# Altium project Reptile_Proj.PrjPcb
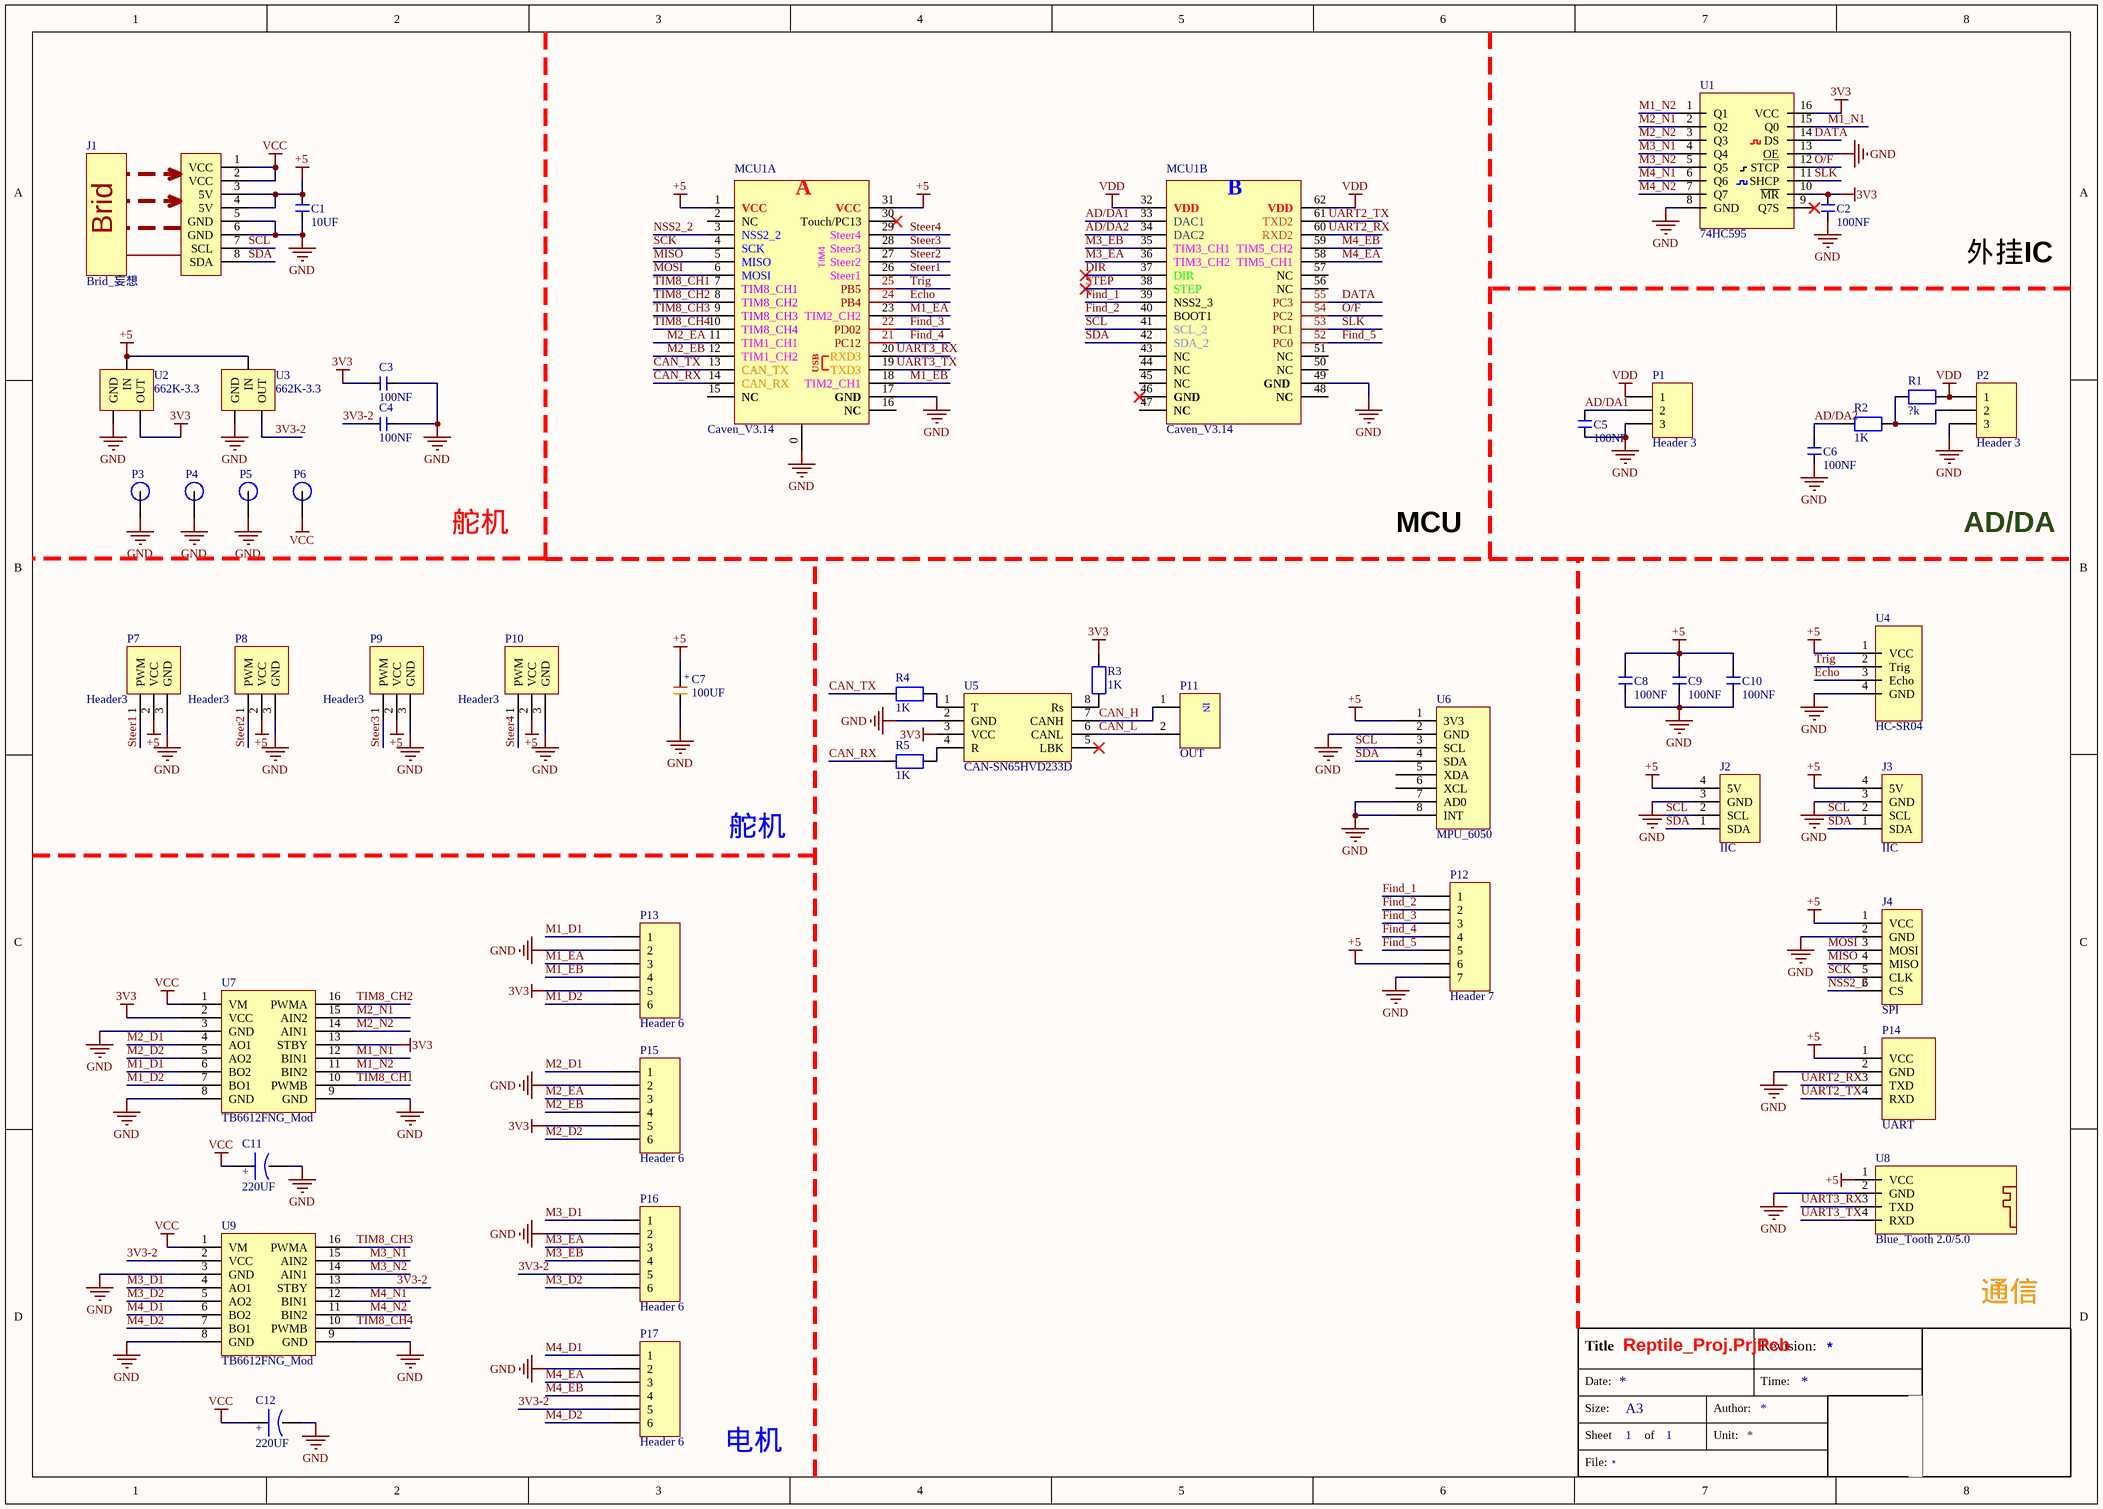
[diagram p0: Sheet.SchDoc]
1 sheet, 48 parts. Net scope: global (net labels, ports and power ports of the same name join across sheets).
Board file: PCB.PcbDoc

## Sheet Sheet.SchDoc
size A3; SheetNumber: 1; SheetTotal: 1

### Parts
C1  10UF  [CAP_1206]
C2  100NF  [CAP_0603]
C3  100NF  [CAP_0603]
C4  100NF  [CAP_0603]
C5  100NF  [CAP_0603]
C6  100NF  [CAP_0603]
C7  100UF  [CAP_3528_B]
C8  100NF  [CAP_0603]
C9  100NF  [CAP_0603]
C10  100NF  [CAP_0603]
C11  220UF  [CAPE_E]
C12  220UF  [CAPE_E]
J1  Brid_妄想  [Brid]
J2  IIC  [Header 2.54X4]
J3  IIC  [IIC-XH2.54-4PIN]
J4  SPI  [Header 2.54X6]
MCU1  Caven_V3.14  [Caven_3.14]  (parts A,B of 2)
P1  Header 3  [Header 2.54X3]
P2  Header 3  [Header 2.54X3]
P3  铜柱6m  [M3x6_L-Type]  (value not drawn)
P4  铜柱6m  [M3x6_L-Type]  (value not drawn)
P5  铜柱6m  [M3x6_L-Type]  (value not drawn)
P6  铜柱6m  [M3x6_L-Type]  (value not drawn)
P7  Header3  [PWM_Steer-F]
P8  Header3  [PWM_Steer-B]
P9  Header3  [PWM_Steer-F]
P10  Header3  [PWM_Steer-B]
P11  OUT  [PIN-2_5.08]
P12  Header 7  [Header H 2.54X7]
P13  Header 6  [XH2.54-WI-6P]
P14  UART  [UART]
P15  Header 6  [XH2.54-WI-6P]
P16  Header 6  [XH2.54-WI-6P]
P17  Header 6  [XH2.54-WI-6P]
R1  ?k  [RESC_0603_2]
R2  1K  [RESC_0603_2]
R3  1K  [RESC_0603_2]
R4  1K  [RESC_0603_2]
R5  1K  [RESC_0603_2]
U1  74HC595  [SOIC_16]
U2  662K-3.3  [SOT23_3]
U3  662K-3.3  [SOT23_3]
U4  HC-SR04  [Ultrasonic]
U5  CAN-SN65HVD233D  [SOIC_8]
U6  MPU_6050  [MPU-G521]
U7  TB6612FNG_Mod  [TB6612FNG]
U8  Blue_Tooth 2.0/5.0  [Header F 2.54X4]
U9  TB6612FNG_Mod  [TB6612FNG]

### Nets
3V3: C2.2 C3.2 P13.5 P15.5 R3.2 U1.10(~{M}~{R}) U1.16(VCC) U2.2(OUT) U5.3(VCC) U7.2(VCC) U7.13(STBY)
+5: C1.1 C7.1 C8.2 C9.2 C10.2 J1.3(5V) J1.4(5V) J2.4(5V) J3.4(5V) J4.1(VCC) MCU1.1(VCC) MCU1.31(VCC) P7.2(VCC) P8.2(VCC) P9.2(VCC) P10.2(VCC) P12.6 P14.1(VCC) U2.3(IN) U3.3(IN) U4.1(VCC) U6.1(3V3) U8.1(VCC)
GND: C1.2 C2.1 C3.1 C4.1 C5.1 C6.1 C7.2 C8.1 C9.1 C10.1 C11.2 C12.2 J1.5(GND) J1.6(GND) J2.3(GND) J3.3(GND) J4.2(GND) MCU1.0 MCU1.17(GND) MCU1.49(GND) P1.3 P2.3 P3.1(IO) P4.1(IO) P5.1(IO) P7.3(GND) P8.3(GND) P9.3(GND) P10.3(GND) P12.7 P13.2 P14.2(GND) P15.2 P16.2 P17.2 U1.8(GND) U1.13(OE) U2.1(GND) U3.1(GND) U4.4(GND) U5.2(GND) U6.2(GND) U6.7(AD0) U6.8(INT) U7.3(GND) U7.8(GND) U7.9(GND) U8.2(GND) U9.3(GND) U9.8(GND) U9.9(GND)
VCC: C11.1 C12.1 J1.1(VCC) J1.2(VCC) P6.1(IO) U7.1(VM) U9.1(VM)
VDD: MCU1.32(VDD) MCU1.62(VDD) P1.1 P2.1 R1.2
3V3-2: C4.2 P16.5 P17.5 U3.2(OUT) U9.2(VCC) U9.13(STBY)
AD/DA1: C5.2 MCU1.33(DAC1) P1.2
AD/DA2: C6.2 MCU1.34(DAC2) R2.2
CAN_H: P11.1 U5.7(CANH)
CAN_L: P11.2 U5.6(CANL)
CAN_RX: MCU1.14(CAN_RX) R5.1
CAN_TX: MCU1.13(CAN_TX) R4.1
DATA: MCU1.55(PC3) U1.14(DS)
DIR: MCU1.37(DIR)
Echo: MCU1.24(PB4) U4.3(Echo)
Find_1: MCU1.39(NSS2_3) P12.1
Find_2: MCU1.40(BOOT1) P12.2
Find_3: MCU1.22(PD02) P12.3
Find_4: MCU1.21(PC12) P12.4
Find_5: MCU1.52(PC0) P12.5
M1_D1: P13.1 U7.6(BO2)
M1_D2: P13.6 U7.7(BO1)
M1_EA: MCU1.23(TIM2_CH2) P13.3
M1_EB: MCU1.18(TIM2_CH1) P13.4
M1_N1: U1.15(Q0) U7.12(BIN1)
M1_N2: U1.1(Q1) U7.11(BIN2)
M2_D1: P15.1 U7.4(AO1)
M2_D2: P15.6 U7.5(AO2)
M2_EA: MCU1.11(TIM1_CH1) P15.3
M2_EB: MCU1.12(TIM1_CH2) P15.4
M2_N1: U1.2(Q2) U7.15(AIN2)
M2_N2: U1.3(Q3) U7.14(AIN1)
M3_D1: P16.1 U9.4(AO1)
M3_D2: P16.6 U9.5(AO2)
M3_EA: MCU1.36(TIM3_CH2) P16.3
M3_EB: MCU1.35(TIM3_CH1) P16.4
M3_N1: U1.4(Q4) U9.15(AIN2)
M3_N2: U1.5(Q5) U9.14(AIN1)
M4_D1: P17.1 U9.6(BO2)
M4_D2: P17.6 U9.7(BO1)
M4_EA: MCU1.58(TIM5_CH1) P17.3
M4_EB: MCU1.59(TIM5_CH2) P17.4
M4_N1: U1.6(Q6) U9.12(BIN1)
M4_N2: U1.7(Q7) U9.11(BIN2)
MISO: J4.4(MISO) MCU1.5(MISO)
MOSI: J4.3(MOSI) MCU1.6(MOSI)
NSS2_2: J4.6(CS) MCU1.3(NSS2_2)
O/F: MCU1.54(PC2) U1.12(STCP)
SCK: J4.5(CLK) MCU1.4(SCK)
SCL: J1.7(SCL) J2.2(SCL) J3.2(SCL) MCU1.41(SCL_2) U6.3(SCL)
SDA: J1.8(SDA) J2.1(SDA) J3.1(SDA) MCU1.42(SDA_2) U6.4(SDA)
SLK: MCU1.53(PC1) U1.11(SHCP)
Steer1: MCU1.26(Steer1) P7.1(PWM)
Steer2: MCU1.27(Steer2) P8.1(PWM)
Steer3: MCU1.28(Steer3) P9.1(PWM)
Steer4: MCU1.29(Steer4) P10.1(PWM)
STEP: MCU1.38(STEP)
TIM8_CH1: MCU1.7(TIM8_CH1) U7.10(PWMB)
TIM8_CH2: MCU1.8(TIM8_CH2) U7.16(PWMA)
TIM8_CH3: MCU1.9(TIM8_CH3) U9.16(PWMA)
TIM8_CH4: MCU1.10(TIM8_CH4) U9.10(PWMB)
Trig: MCU1.25(PB5) U4.2(Trig)
UART2_RX: MCU1.60(RXD2) P14.3(TXD)
UART2_TX: MCU1.61(TXD2) P14.4(RXD)
UART3_RX: MCU1.20(RXD3) U8.3(TXD)
UART3_TX: MCU1.19(TXD3) U8.4(RXD)
NetP2_2: P2.2 R1.1 R2.1
NetR3_1: R3.1 U5.8(Rs)
NetR4_2: R4.2 U5.1(T)
NetR5_2: R5.2 U5.4(R)

Not connected (* = marked no-connect by the designer): MCU1 2(NC) 15(NC) 16(NC) 30(Touch/PC13)* 43(NC) 44(NC) 45(NC) 46(GND)* 47(NC) 48(NC) 50(NC) 51(NC) 56(NC) 57(NC); U1 9(Q7S)*; U5 5(LBK)*; U6 5(XDA) 6(XCL)

### Notes on the sheet
- 外挂IC
- 舵机
- MCU
- AD/DA
- 通信
- 电机
- Title
- Date:
- Revision:
- Time:
- Size:
- Sheet
- A3
- of
- Author:
- Unit:
- File:
- (in symbol CAP_BIG) +
- (in symbol CAP_TA) +
- (in symbol Caven_V3.14, part A) A; TIM4; USB
- (in symbol Caven_V3.14, part B) B
- (in symbol IN _2PIN) IN

### Library data of the parts
C1-C6 C8-C10 = CAP: CAP  12~50V
C7 = CAP_TA: CAP  6~12V  钽电容
C11 C12 = CAP_BIG: CAP 12V ~ 50V   电解电容
J1 = Brid
J2 J3 = IIC: Heard
J4 = SPI: Heard
MCU1 = Caven_V3.14: MCU_STM32F103RE
P1 P2 = Header 3: Header, 3-Pin; LatestRevisionDate: 17-Jul-2002; LatestRevisionNote: Re-released for DXP Platform.; Publisher: Altium Limited
P3-P6 = Pillar: IN-OUT
P7-P10 = PWM_D: Header
P11 = IN _2PIN: Header
P12 = Header 7: Header, 7-Pin; LatestRevisionDate: 17-Jul-2002; LatestRevisionNote: Re-released for DXP Platform.; Publisher: Altium Limited
P13 P15-P17 = Header 6: Header, 6-Pin; LatestRevisionDate: 17-Jul-2002; LatestRevisionNote: Re-released for DXP Platform.; Publisher: Altium Limited
P14 = UART: Header
R1-R5 = RES: RES 贴片
U1 = 74HC595: IC
U2 U3 = 662K: DC-DC
U4 = Ultrasonic: Mode
U5 = CAN
U6 = MPU_6050: MODE
U7 U9 = TB6612FNG_Mod: MODE
U8 = HC-02/06: MODE